# Altium project 555cv.prjPCB.PrjPcb (part 4 of 4)

## Sheet Contactor_Switching.SchDoc
size A4; DocumentNumber: 7; SheetNumber: 7; SheetTotal: 8
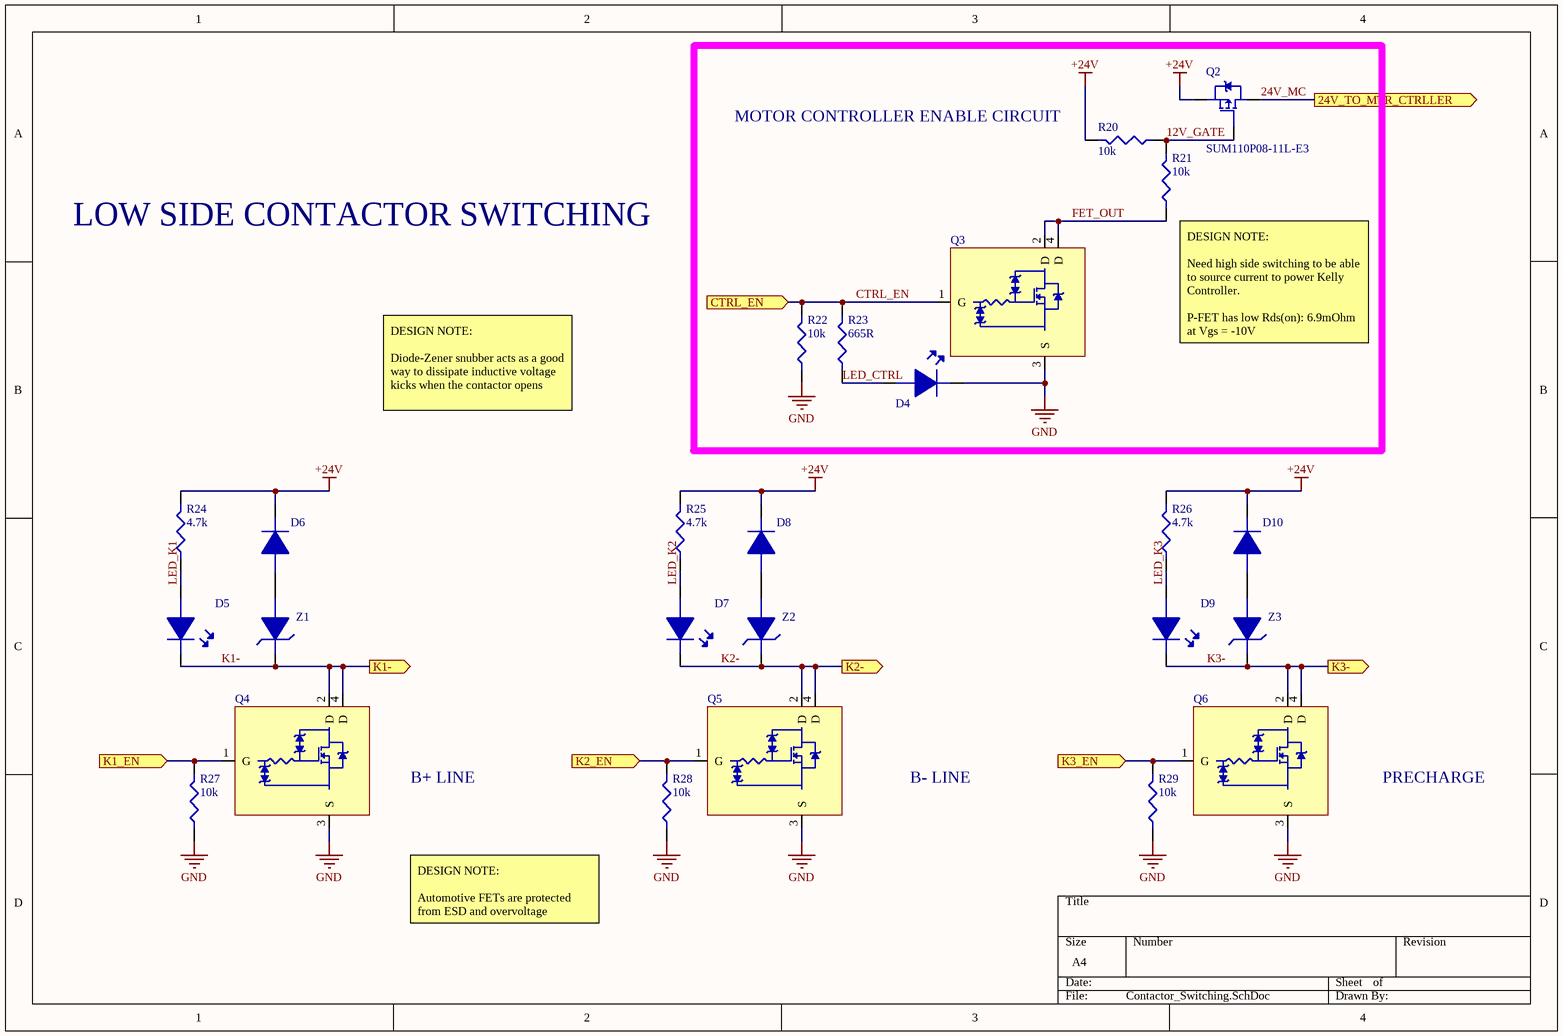
[diagram p6: Contactor_Switching.SchDoc]

### Parts
D4  LTST-C191TBKT-5A  [LED_0603]  (value not drawn)
D5  LTST-C191TBKT-5A  [LED_0603]  (value not drawn)
D6  S3BB-TP  [DO-214AA_Diode]  (value not drawn)
D7  LTST-C191TBKT-5A  [LED_0603]  (value not drawn)
D8  S3BB-TP  [DO-214AA_Diode]  (value not drawn)
D9  LTST-C191TBKT-5A  [LED_0603]  (value not drawn)
D10  S3BB-TP  [DO-214AA_Diode]  (value not drawn)
Q2  SUM110P08-11L-E3  [D2PAK_FETs]
Q3  NCV8406ASTT1G  [SOT-223_NFET]  (value not drawn)
Q4  NCV8406ASTT1G  [SOT-223_NFET]  (value not drawn)
Q5  NCV8406ASTT1G  [SOT-223_NFET]  (value not drawn)
Q6  NCV8406ASTT1G  [SOT-223_NFET]  (value not drawn)
R20  10k  [R0805]
R21  10k  [R0805]
R22  10k  [R0805]
R23  665R  [R0805]
R24  4.7k  [R0805]
R25  4.7k  [R0805]
R26  4.7k  [R0805]
R27  10k  [R0805]
R28  10k  [R0805]
R29  10k  [R0805]
Z1  12V  [DO-214AA_Diode]  (value not drawn)
Z2  12V  [DO-214AA_Diode]  (value not drawn)
Z3  12V  [DO-214AA_Diode]  (value not drawn)

### Blocks framed on the sheet
MOTOR CONTROLLER ENABLE CIRCUIT: D4 Q2 Q3 R20-R23

### Ports
24V_TO_MTR_CTRLLER, CTRL_EN, K1-, K1_EN, K2-, K2_EN, K3-, K3_EN

### Nets
+24V: D6.2 D8.2 D10.2 Q2.4 R20.2 R24.2 R25.2 R26.2
GND: D4.2 Q3.3(S) Q4.3(S) Q5.3(S) Q6.3(S) R22.1 R27.1 R28.1 R29.1
12V_GATE: Q2.1 R20.1 R21.2
24V_MC: Q2.3 ; port 24V_TO_MTR_CTRLLER
CTRL_EN: Q3.1(G) R22.2 R23.2 ; port CTRL_EN
FET_OUT: Q3.2(D) Q3.4(D) R21.1
K1-: D5.2 Q4.2(D) Q4.4(D) Z1.2 ; port K1-
K1_EN: Q4.1(G) R27.2 ; port K1_EN
K2-: D7.2 Q5.2(D) Q5.4(D) Z2.2 ; port K2-
K2_EN: Q5.1(G) R28.2 ; port K2_EN
K3-: D9.2 Q6.2(D) Q6.4(D) Z3.2 ; port K3-
K3_EN: Q6.1(G) R29.2 ; port K3_EN
LED_CTRL: D4.1 R23.1
LED_K1: D5.1 R24.1
LED_K2: D7.1 R25.1
LED_K3: D9.1 R26.1
NetD6_1: D6.1 Z1.1
NetD8_1: D8.1 Z2.1
NetD10_1: D10.1 Z3.1

### Notes on the sheet
- LOW SIDE CONTACTOR SWITCHING
- (near R21) DESIGN NOTE:
  Need high side switching to be able to source current to power Kelly Controller.
  P-FET has low Rds(on): 6.9mOhm at Vgs = -10V
- DESIGN NOTE:
  Diode-Zener snubber acts as a good way to dissipate inductive voltage kicks when the contactor opens
- B+ LINE
- B- LINE
- PRECHARGE
- DESIGN NOTE:
  Automotive FETs are protected from ESD and overvoltage

### Library data of the parts
D4 D5 D7 D9 = LTST-C191TBKT-5A: LED BLUE CLEAR 0603 SMD; Manufacturer: Vishay Lite-On; Lens Colour: Colorless; Lens Style: Diffused,Colorless,Rectangular; Viewing Angle: 130°; Forward Current: 20mA; Forward Voltage: 2.8V; Luminous Intensity: 15mcd; Test Current: 5mA; Dominant Wavelength: 473nm; Number of LEDs: 1; Voltage: 29V; Supplier 1: Digi-Key; Manufacturer Part Number: LTST-C191TBKT-5A; Stock 1: 2918; Pricing 1: 1=0.52, 10=0.376, 25=0.2884, 100=0.1881, 250=0.138, 500=0.117, 1000=0.0961, 2500=0.0836 (USD); Mount: Surface Mount; Case/Package: 0603; Colour: Blue; Case Code (Metric): 1608; Case Code (Imperial): 0603; Min Operating Temperature: -20°C; Max Operating Temperature: 80°C; Packaging: Tape and Reel; Package Quantity: 5000; Illumination Colour: Blue; Lens Transparency: Clear; Length: 1.6mm; Height: 0.55mm; Width: 0.8mm; Radiation Hardening: No; ComponentLink1URL: http://components.arrow.com/part/dataview/52218576S9813001N1331; ComponentLink1Description: http://components.arrow.com/part/dataview/52218576S9813001N1331; ComponentLink2URL: http://optoelectronics.liteon.com/zh-cn/api/DwonloadFileHandler.ashx?txtSpecNo=DS22-2003-020&txtPartNo=LTST-C191TBKT-5A; ComponentLink2Description: http://optoelectronics.liteon.com/zh-cn/api/DwonloadFileHandler.ashx?txtSpecNo=DS22-2003-020&txtPartNo=LTST-C191TBKT-5A; Supplier Part Number 1: 160-2212-6-ND
D6 D8 D10 = S3BB-TP: DIODE GEN PURP 100V 3A DO214AA; Manufacturer: MCC; Max Surge Current: 100A; Forward Voltage: 1.15V; Peak Reverse Current: 10uA; Element Configuration: Single; Supplier 1: Digi-Key; Manufacturer Part Number: S3BB-TP; Stock 1: 10943; Pricing 1: 1=0.56, 10=0.441, 25=0.372, 100=0.3028, 250=0.2509, 500=0.2076, 1000=0.1557 (USD); Mount: Surface Mount; Number of Pins: 2; Packaging: Tape and Reel; Package Quantity: 1; Reverse Voltage (DC): 100V; Average Rectified Current: 3A; Peak Non-Repetitive Surge Current: 100A; Max Repetitive Reverse Voltage (Vrrm): 100V; Radiation Hardening: No; Lead Free: Lead Free; ComponentLink1URL: https://datasheet.ciiva.com/914/s3ab-s3mbsmb-914278.pdf; ComponentLink1Description: https://datasheet.ciiva.com/914/s3ab-s3mbsmb-914278.pdf; ComponentLink2URL: https://datasheet.ciiva.com/914/s3ab-s3mbsmb-914279.pdf; ComponentLink2Description: https://datasheet.ciiva.com/914/s3ab-s3mbsmb-914279.pdf; ComponentLink3URL: https://datasheet.ciiva.com/914/s3ab-s3mbsmb-914280.pdf; ComponentLink3Description: https://datasheet.ciiva.com/914/s3ab-s3mbsmb-914280.pdf; ComponentLink4URL: https://datasheet.ciiva.com/15200/getdatasheetpartid-686538-15200554.pdf; ComponentLink4Description: https://datasheet.ciiva.com/15200/getdatasheetpartid-686538-15200554.pdf; ComponentLink5URL: https://datasheet.ciiva.com/17437/s3ab-s3mbsmb-17437836.pdf; ComponentLink5Description: https://datasheet.ciiva.com/17437/s3ab-s3mbsmb-17437836.pdf; Supplier Part Number 1: S3BB-TPMSCT-ND
Q2 = SUM110P08-11L-E3: MOSFET P-CH 80V 23.5A 3-Pin(2+Tab) TO-263; Manufacturer: Vishay; Drain to Source Voltage (Vdss): -80V; Threshold Voltage: -3V; Max Power Dissipation: 375W; Number of Elements: 1; Power Dissipation: 13.6W; Gate to Source Voltage (Vgs): 20V; Fall Time: 550ns; Turn-On Delay Time: 20ns; Rise Time: 330ns; Turn-Off Delay Time: 135ns; Drain to Source Resistance: 11.1mR; Supplier 1: Digi-Key; Manufacturer Part Number: SUM110P08-11L-E3; Stock 1: 11394; Pricing 1: 1=5.01, 10=4.503, 25=4.2572, 100=3.6896, 250=3.5004 (USD); Mount: Surface Mount; Case/Package: TO-263; Number of Pins: 3; Contact Plating: Tin,Matte; Min Operating Temperature: -50°C; Max Operating Temperature: 175°C; Continuous Drain Current (ID): 23.5A; Packaging: Tape and Reel; REACH SVHC: No SVHC; Lead Free: Lead Free; ComponentLink1URL: https://datasheet.ciiva.com/25652/sum110p0-25652054.pdf; ComponentLink1Description: https://datasheet.ciiva.com/25652/sum110p0-25652054.pdf; Supplier Part Number 1: SUM110P08-11L-E3CT-ND
Q3-Q6 = NCV8406ASTT1G: MOSFET Self-Protected Low Side Driver Automotive 4-Pin(3+Tab) SOT-223 T/R; Manufacturer: ON Semiconductor; Number of Outputs: 1; Max Output Current: 7A; Interface: On/Off; On-State Resistance: 210mR; Fault Protection: Over Voltage,Over Temperature; Supplier 1: Digi-Key; Manufacturer Part Number: NCV8406ASTT1G; Stock 1: 277; Pricing 1: 1=1.41, 10=1.258, 100=0.981, 500=0.8104 (USD); Mount: Surface Mount; Case/Package: TO-261-4; Number of Pins: 4; Min Operating Temperature: -40°C; Max Operating Temperature: 150°C; Packaging: Tape and Reel; Package Quantity: 1000; Length: 6.5mm; Height: 1.57mm; Radiation Hardening: No; Lead Free: Lead Free; Halogen Free: Halogen Free; ComponentLink1URL: https://datasheet.ciiva.com/15265/htmls5-15265281.pdf; ComponentLink1Description: https://datasheet.ciiva.com/15265/htmls5-15265281.pdf; ComponentLink2URL: https://datasheet.ciiva.com/1956/ncv8406-d-1956280.pdf; ComponentLink2Description: https://datasheet.ciiva.com/1956/ncv8406-d-1956280.pdf; ComponentLink3URL: https://datasheet.ciiva.com/16217/ncv8406-d-16217275.pdf; ComponentLink3Description: https://datasheet.ciiva.com/16217/ncv8406-d-16217275.pdf; Supplier Part Number 1: NCV8406ASTT1GOSDKR-ND
R20-R22 R27-R29 = RC0805FR-071KL: RES SMD 10K OHM 1% 1/8W 0805; Manufacturer: Yageo Phycomp; Temperature Coefficient: 100ppm/°C; Resistance: 1KR; Voltage Rating (DC): 150V; Power Rating: 125mW; Supplier 1: Digi-Key; Manufacturer Part Number: RC0805FR-071KL; Stock 1: 5527973; Pricing 1: 1=0.1, 10=0.022, 100=0.0088, 1000=0.004, 2500=0.0034 (USD); Case/Package: 0805; Number of Pins: 2; Min Operating Temperature: -55°C; Max Operating Temperature: 155°C; Tolerance: 1%; Packaging: Cut Tape; Length: 2mm; Height: 0.5mm; Width: 1.25mm; Depth: 1.25mm; REACH SVHC: No SVHC; Lead Free: Lead Free
R23 = RC0805FR-07665RL: RES SMD 665 OHM 1% 1/8W 0805; Manufacturer: Yageo; Power Rating: 125mW; Temperature Coefficient: 100ppm/°C; Voltage Rating (DC): 150V; Supplier 1: Digi-Key; Manufacturer Part Number: RC0805FR-07665RL; Stock 1: 51898; Pricing 1: 1=0.1, 10=0.022, 100=0.0088, 1000=0.004, 2500=0.0034 (USD); Case/Package: 0805; Case Code (Imperial): 0805; Case Code (Metric): 2012; Min Operating Temperature: -55°C; Max Operating Temperature: 155°C; Resistance: 665R; Tolerance: 1%; Packaging: Tape and Reel; Composition: Thick Film; Package Quantity: 1; Voltage Rating: 150V; Termination: SMD/SMT; Number of Terminations: 2; Military Standard: Not; Max Power Dissipation: 125mW; Length: 2mm; Height: 0.024inch; Width: 1.25mm; Depth: 1.25mm; Lead Free: Lead Free; ComponentLink1URL: https://datasheet.ciiva.com/17423/rc0805-17423095.pdf; ComponentLink1Description: https://datasheet.ciiva.com/17423/rc0805-17423095.pdf; ComponentLink2URL: https://datasheet.ciiva.com/12561/rc0805-257173-12561528.pdf; ComponentLink2Description: https://datasheet.ciiva.com/12561/rc0805-257173-12561528.pdf; ComponentLink3URL: https://datasheet.ciiva.com/2457/pyu-r-int-thick-7-2457788.pdf; ComponentLink3Description: https://datasheet.ciiva.com/2457/pyu-r-int-thick-7-2457788.pdf; ComponentLink4URL: https://datasheet.ciiva.com/2457/pyu-r-int-thick-7-2457789.pdf; ComponentLink4Description: https://datasheet.ciiva.com/2457/pyu-r-int-thick-7-2457789.pdf; ComponentLink5URL: https://datasheet.ciiva.com/2457/pyu-r-int-thick-7-2457790.pdf; ComponentLink5Description: https://datasheet.ciiva.com/2457/pyu-r-int-thick-7-2457790.pdf; Supplier Part Number 1: 311-665CRDKR-ND
R24-R26 = RC0805FR-074K7L: RES SMD 4.7K OHM 1% 1/8W 0805; Manufacturer: Yageo; Resistance: 4.7KR; Temperature Coefficient: 100ppm/°C; Power Rating: 125mW; Voltage Rating: 150V; Supplier 1: Digi-Key; Manufacturer Part Number: RC0805FR-074K7L; Stock 1: 2632902; Pricing 1: 1=0.1, 10=0.022, 100=0.0088, 1000=0.004, 2500=0.0034 (USD); Case/Package: 0805; Number of Pins: 2; Case Code (Metric): 2012; Case Code (Imperial): 0805; Min Operating Temperature: -55°C; Max Operating Temperature: 155°C; Packaging: Tape and Reel; Tolerance: 1%; Composition: Thick Film; Voltage Rating (DC): 150V; Termination: SMD/SMT; Military Standard: Not; Package Quantity: 5000; Number of Terminations: 2; Max Power Dissipation: 125mW; Length: 0.079inch; Height: 0.024inch; Width: 0.049inch; Depth: 1.25mm; REACH SVHC: No SVHC; Lead Free: Lead Free; ComponentLink1URL: https://datasheet.ciiva.com/11808/0900766b8106beab-11808155.pdf; ComponentLink1Description: https://datasheet.ciiva.com/11808/0900766b8106beab-11808155.pdf; ComponentLink2URL: https://datasheet.ciiva.com/7941/444164-7941804.pdf; ComponentLink2Description: https://datasheet.ciiva.com/7941/444164-7941804.pdf; ComponentLink3URL: https://datasheet.ciiva.com/7941/1686128-7941805.pdf; ComponentLink3Description: https://datasheet.ciiva.com/7941/1686128-7941805.pdf; ComponentLink4URL: https://datasheet.ciiva.com/7941/444164-7941806.pdf; ComponentLink4Description: https://datasheet.ciiva.com/7941/444164-7941806.pdf; ComponentLink5URL: https://datasheet.ciiva.com/6547/pyu-r-int-thick-7-6547263.pdf; ComponentLink5Description: https://datasheet.ciiva.com/6547/pyu-r-int-thick-7-6547263.pdf; ComponentLink6URL: https://datasheet.ciiva.com/46447/444164-46447583.pdf; ComponentLink6Description: https://datasheet.ciiva.com/46447/444164-46447583.pdf; Supplier Part Number 1: 311-4.70KCRDKR-ND
Z1-Z3 = SMBJ5349B-TP: DIODE ZENER 12V 5W DO214AA; Manufacturer: MCC; Tolerance: 5%; Forward Voltage: 1.2V; Max Reverse Leakage Current: 2uA; Impedance: 2.5R; Zener Current: 395mA; Test Current: 100mA; Element Configuration: Single; Supplier 1: Digi-Key; Manufacturer Part Number: SMBJ5349B-TP; Stock 1: 41768; Pricing 1: 1=0.65, 10=0.57, 25=0.5044, 100=0.4394, 250=0.3824, 500=0.3255, 1000=0.2604 (USD); Mount: Surface Mount; Case/Package: SMB; Number of Pins: 2; Min Operating Temperature: -55°C; Max Operating Temperature: 150°C; Package Quantity: 3000; Packaging: Tape and Reel; Power Dissipation: 5W; Zener Voltage: 12V; Voltage Tolerance: 5%; Max Power Dissipation: 5W; Working Voltage: 12V; Peak Reverse Current: 2uA; Radiation Hardening: No; Lead Free: Lead Free; ComponentLink1URL: https://datasheet.ciiva.com/894/smbj5338b-smbj5388bsmb-894182.pdf; ComponentLink1Description: https://datasheet.ciiva.com/894/smbj5338b-smbj5388bsmb-894182.pdf; ComponentLink2URL: https://datasheet.ciiva.com/894/smbj5338b-smbj5388bsmb-894183.pdf; ComponentLink2Description: https://datasheet.ciiva.com/894/smbj5338b-smbj5388bsmb-894183.pdf; ComponentLink3URL: https://datasheet.ciiva.com/894/smbj5338b-smbj5388bsmb-894184.pdf; ComponentLink3Description: https://datasheet.ciiva.com/894/smbj5338b-smbj5388bsmb-894184.pdf; ComponentLink4URL: https://datasheet.ciiva.com/17444/smbj5338b-smbj5388bsmb-17444298.pdf; ComponentLink4Description: https://datasheet.ciiva.com/17444/smbj5338b-smbj5388bsmb-17444298.pdf; ComponentLink5URL: https://datasheet.ciiva.com/26844/getdatasheetpartid-147575-26844923.pdf; ComponentLink5Description: https://datasheet.ciiva.com/26844/getdatasheetpartid-147575-26844923.pdf; Supplier Part Number 1: SMBJ5349B-TPMSDKR-ND

## Sheet GPIO_Pullups_Pulldowns.SchDoc
size A4; DocumentNumber: 6; SheetNumber: 7; SheetTotal: 7
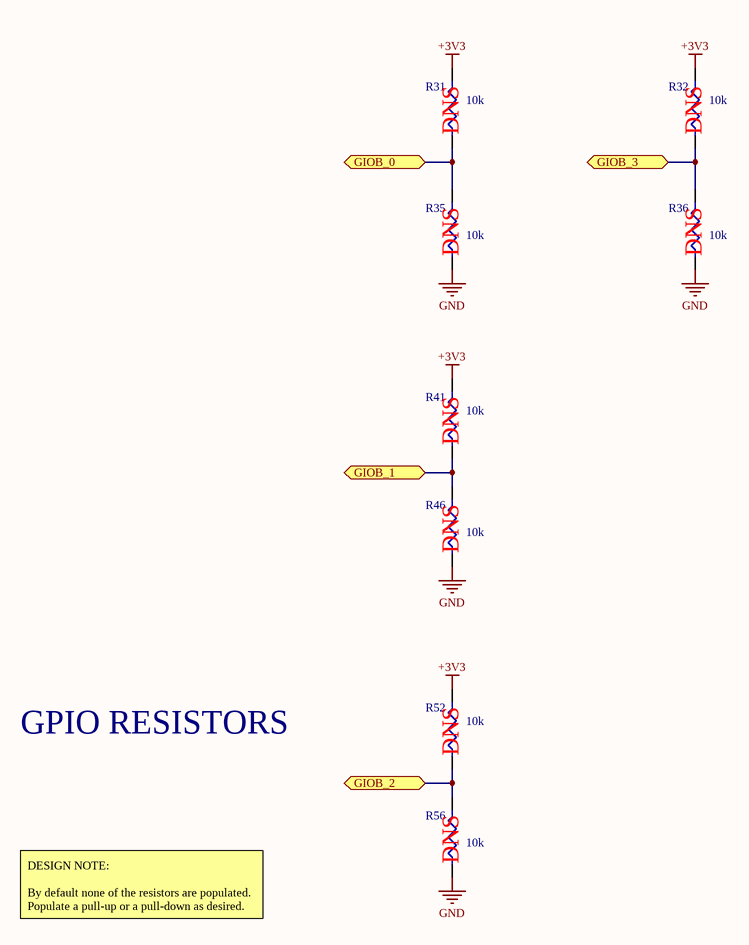
[diagram p7: GPIO_Pullups_Pulldowns.SchDoc]

### Parts
R31  10k  [R0805]
R32  10k  [R0805]
R35  10k  [R0805]
R36  10k  [R0805]
R41  10k  [R0805]
R46  10k  [R0805]
R52  10k  [R0805]
R56  10k  [R0805]

### Ports
GIOB_0, GIOB_1, GIOB_2, GIOB_3

### Nets
+3V3: R31.2 R32.2 R41.2 R52.2
GND: R35.1 R36.1 R46.1 R56.1
GIOB_0: R31.1 R35.2 ; port GIOB_0
GIOB_1: R41.1 R46.2 ; port GIOB_1
GIOB_2: R52.1 R56.2 ; port GIOB_2
GIOB_3: R32.1 R36.2 ; port GIOB_3

### Notes on the sheet
- (near R31) DNS
- (near R32) DNS
- (near R35) DNS
- (near R36) DNS
- (near R41) DNS
- (near R46) DNS
- GPIO RESISTORS
- (near R52) DNS
- DESIGN NOTE:
  By default none of the resistors are populated. Populate a pull-up or a pull-down as desired.
- (near R56) DNS

### Library data of the parts
R31 R32 R35 R36 R41 R46 R52 R56 = RC0805FR-071KL: as R20 on sheet Contactor_Switching; Supplier 1: Digi-Key; Manufacturer Part Number: RC0805FR-071KL; Stock 1: 5527973; Pricing 1: 1=0.1, 10=0.022, 100=0.0088, 1000=0.004, 2500=0.0034 (USD); Case/Package: 0805; Number of Pins: 2; Min Operating Temperature: -55°C; Max Operating Temperature: 155°C; Tolerance: 1%; Packaging: Cut Tape; Length: 2mm; Height: 0.5mm; Width: 1.25mm; Depth: 1.25mm; REACH SVHC: No SVHC; Lead Free: Lead Free

## Sheet ADC_Decoupling.SchDoc
size A4; DocumentNumber: 8; SheetNumber: 8; SheetTotal: 8
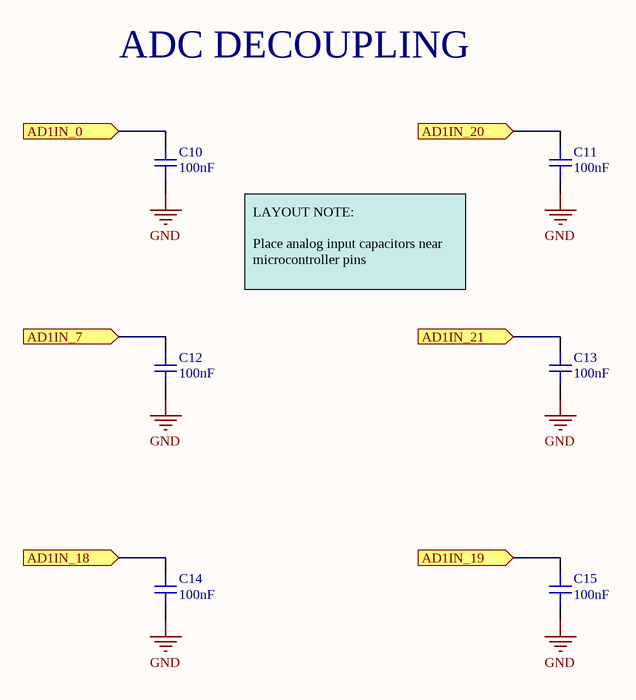
[diagram p8: ADC_Decoupling.SchDoc]

### Parts
C10  100nF  [C0805]
C11  100nF  [C0805]
C12  100nF  [C0805]
C13  100nF  [C0805]
C14  100nF  [C0805]
C15  100nF  [C0805]

### Ports
AD1IN_0, AD1IN_7, AD1IN_18, AD1IN_19, AD1IN_20, AD1IN_21

### Nets
GND: C10.1 C11.1 C12.1 C13.1 C14.1 C15.1
AD1IN_0: C10.2 ; port AD1IN_0
AD1IN_7: C12.2 ; port AD1IN_7
AD1IN_18: C14.2 ; port AD1IN_18
AD1IN_19: C15.2 ; port AD1IN_19
AD1IN_20: C11.2 ; port AD1IN_20
AD1IN_21: C13.2 ; port AD1IN_21

### Notes on the sheet
- ADC DECOUPLING
- LAYOUT NOTE:
  Place analog input capacitors near microcontroller pins

### Library data of the parts
C10-C15 = GRM21B7U1A104JA01L: CAP MLCC 100nF 10Volts U2J 5%; Manufacturer: Murata; Voltage Rating: 10V; Supplier 1: Digi-Key; Manufacturer Part Number: GRM21B7U1A104JA01L; Stock 1: 6000; Pricing 1: 1=0.46, 10=0.32, 100=0.192, 500=0.144, 1000=0.1216 (USD); Mount: Surface Mount; Case/Package: 0805; Case Code (Imperial): 0805; Case Code (Metric): 2012; Min Operating Temperature: -55°C; Max Operating Temperature: 125°C; Capacitance: 100nF; Voltage Rating (DC): 10V; Tolerance: 5%; Packaging: Tape and Reel; Package Quantity: 3000; Dielectric: U2J; Termination: SMD/SMT; Length: 2mm; Height: 1.25mm; Width: 0.049inch; Thickness: 0.053inch; Depth: 1.25mm; Radiation Hardening: No; ComponentLink1URL: https://datasheet.ciiva.com/5424/product-5424660.pdf; ComponentLink1Description: https://datasheet.ciiva.com/5424/product-5424660.pdf; ComponentLink2URL: https://datasheet.ciiva.com/17451/product-17451845.pdf; ComponentLink2Description: https://datasheet.ciiva.com/17451/product-17451845.pdf; ComponentLink3URL: https://datasheet.ciiva.com/11618/product-11618924.pdf; ComponentLink3Description: https://datasheet.ciiva.com/11618/product-11618924.pdf; Supplier Part Number 1: 490-11592-6-ND

## Nets that join several sheets
+3V3: Connectors (R30.2 R38.2), Power_Sensing (5 pins), Power_MCU (17 pins), MCU_Signals (8 pins), GPIO_Pullups_Pulldowns (R31.2 R32.2 R41.2 R52.2)
+5V: Connectors (X1.9 X1.19 X2.13 X3.9), Power_Sensing (10 pins), VCU_Schematic (R6.2 R7.2 R8.2 R9.2), MCU_Signals (C30.2 R39.1 U9.66 U9.69), CAN (R10.2 R15.2)
+5V_BAT: Power_Sensing (U2.3), MCU_Signals (C46.2 U10.8)
+5V_PRE-FUSE: Power_Sensing (F2.1), MCU_Signals (U10.7)
+24V: Connectors (5 pins), Power_Sensing (6 pins), Contactor_Switching (8 pins)
GND: Connectors (11 pins), Power_Sensing (18 pins), Power_MCU (44 pins), VCU_Schematic (11 pins), MCU_Signals (19 pins), CAN (C8.1 C9.1 U7.3 U8.3), Contactor_Switching (9 pins), GPIO_Pullups_Pulldowns (R35.1 R36.1 R46.1 R56.1), ADC_Decoupling (6 pins)
24V_GND: Connectors (X5.2), Power_Sensing (Q1.4)
24V_IN: Connectors (X5.1), Power_Sensing (F1.1)
24V_MC: Connectors (X3.7), Contactor_Switching (Q2.3)
AD1IN_0: Connectors (X1.11), VCU_Schematic (D17.1 TP6.1 U9.60), ADC_Decoupling (C10.2)
AD1IN_7: Connectors (X2.8), VCU_Schematic (TP10.1 U9.61), ADC_Decoupling (C12.2)
AD1IN_18: Connectors (X2.9), VCU_Schematic (TP11.1 U9.62), ADC_Decoupling (C14.2)
AD1IN_19: Connectors (X2.10), VCU_Schematic (TP8.1 U9.63), ADC_Decoupling (C15.2)
AD1IN_20: Connectors (X1.12), VCU_Schematic (TP12.1 U9.64), ADC_Decoupling (C11.2)
AD1IN_21: Connectors (X1.13), VCU_Schematic (TP9.1 U9.65), ADC_Decoupling (C13.2)
CAN_H1: Connectors (X1.6), CAN (JP1.2 JP2.2 R11.2 U7.7)
CAN_H2: Connectors (X3.2 X3.4), CAN (JP3.2 JP4.2 R16.2 U8.7)
CAN_L1: Connectors (X1.5), CAN (R12.1 R13.1 R14.2 U7.6)
CAN_L2: Connectors (X3.1 X3.3), CAN (R17.1 R18.1 R19.2 U8.6)
CTRL_EN: VCU_Schematic (U9.9), Contactor_Switching (Q3.1 R22.2 R23.2)
DAC_OUTPUT: Connectors (X3.6), VCU_Schematic (C6.2 R64.2 TP13.1 U6.8)
DCAN1_RX: VCU_Schematic (U9.90), CAN (R14.1 U7.4)
DCAN1_TX: VCU_Schematic (U9.89), CAN (R11.1 U7.1)
DCAN2_RX: VCU_Schematic (U9.129), CAN (R19.1 U8.4)
DCAN2_TX: VCU_Schematic (U9.128), CAN (R16.1 U8.1)
GIOB_0: Connectors (X4.13), VCU_Schematic (U9.126), GPIO_Pullups_Pulldowns (R31.1 R35.2)
GIOB_1: Connectors (X4.14), VCU_Schematic (U9.133), GPIO_Pullups_Pulldowns (R41.1 R46.2)
GIOB_2: Connectors (X4.15), VCU_Schematic (U9.142), GPIO_Pullups_Pulldowns (R52.1 R56.2)
GIOB_3: Connectors (X4.16), VCU_Schematic (U9.1), GPIO_Pullups_Pulldowns (R32.1 R36.2)
GPA0: Connectors (X4.8), VCU_Schematic (U5.21)
GPA1: Connectors (X4.7), VCU_Schematic (U5.22)
GPA2: Connectors (X4.6), VCU_Schematic (U5.23)
GPA3: Connectors (X4.5), VCU_Schematic (U5.24)
GPA4: Connectors (X4.4), VCU_Schematic (U5.25)
GPA5: Connectors (X4.3), VCU_Schematic (U5.26)
GPA6: Connectors (X4.2), VCU_Schematic (U5.27)
GPA7: Connectors (X4.1), VCU_Schematic (U5.28)
I2C_SCL: Connectors (X1.3), Power_Sensing (U1.5), VCU_Schematic (JP6.1 R6.1 U9.3)
I2C_SDA: Connectors (X1.4), Power_Sensing (U1.4), VCU_Schematic (JP6.2 R7.1 U9.4)
K1-: Connectors (X2.2), Contactor_Switching (D5.2 Q4.2 Q4.4 Z1.2)
K1_EN: VCU_Schematic (U9.16), Contactor_Switching (Q4.1 R27.2)
K2-: Connectors (X2.4), Contactor_Switching (D7.2 Q5.2 Q5.4 Z2.2)
K2_EN: VCU_Schematic (U9.22), Contactor_Switching (Q5.1 R28.2)
K3-: Connectors (X2.6), Contactor_Switching (D9.2 Q6.2 Q6.4 Z3.2)
K3_EN: VCU_Schematic (U9.14), Contactor_Switching (Q6.1 R29.2)
MD_EN: Connectors (R30.1 X1.1), VCU_Schematic (U9.2)
MD_RUN: Connectors (R38.1 X1.2), VCU_Schematic (U9.5)
SCI_RX: VCU_Schematic (JP5.1 U9.38), MCU_Signals (U11.2)
SCI_TX: VCU_Schematic (JP5.2 U9.39), MCU_Signals (U11.30)